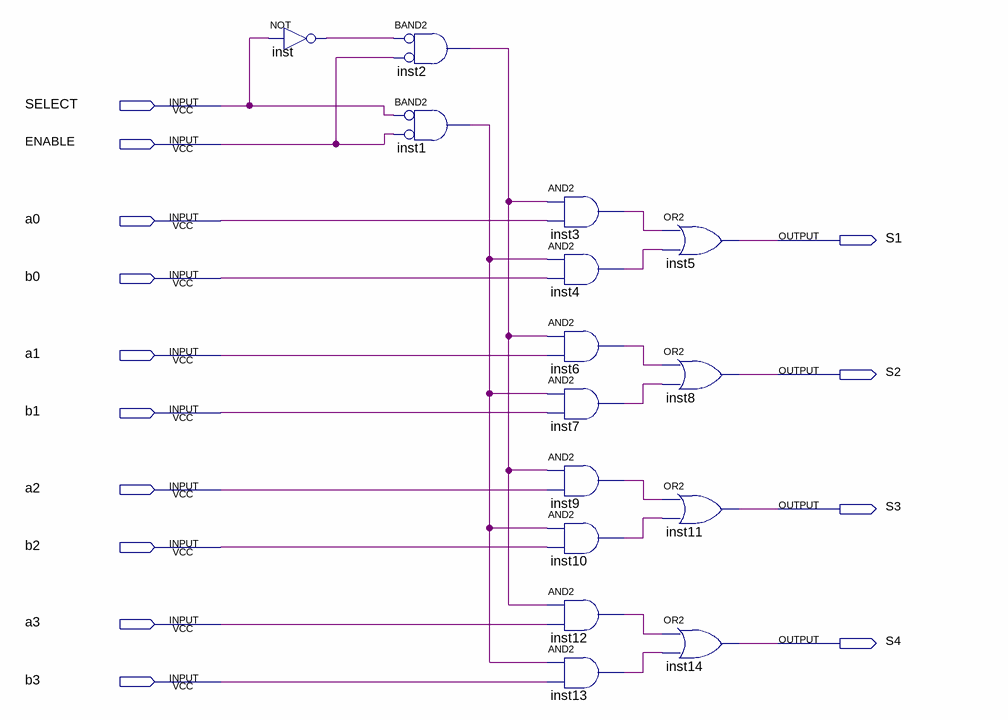
[diagram p0: schematic sheet]
// Quartus schematic CI74LS157_MUX.bdf as structural Verilog: 15 symbols, 14 pins
module CI74LS157_MUX (
  input  SELECT,
  input  ENABLE,
  input  a0,
  input  b0,
  input  a1,
  input  b1,
  input  a2,
  input  b2,
  input  a3,
  input  b3,
  output S1,
  output S2,
  output S3,
  output S4
);

  wire inst1_out, inst2_out, inst3_out, inst4_out, inst6_out, inst7_out, inst9_out, inst10_out, inst12_out,
       inst13_out, inst_out;

  not inst (inst_out, SELECT);
  and inst2 (inst2_out, ~inst_out, ~ENABLE);  // BAND2
  and inst1 (inst1_out, ~SELECT, ~ENABLE);  // BAND2
  and inst3 (inst3_out, inst2_out, a0);
  and inst4 (inst4_out, inst1_out, b0);
  and inst6 (inst6_out, inst2_out, a1);
  and inst7 (inst7_out, inst1_out, b1);
  and inst9 (inst9_out, inst2_out, a2);
  and inst10 (inst10_out, inst1_out, b2);
  and inst12 (inst12_out, inst2_out, a3);
  and inst13 (inst13_out, inst1_out, b3);
  or inst5 (S1, inst3_out, inst4_out);
  or inst8 (S2, inst6_out, inst7_out);
  or inst11 (S3, inst9_out, inst10_out);
  or inst14 (S4, inst12_out, inst13_out);
endmodule
